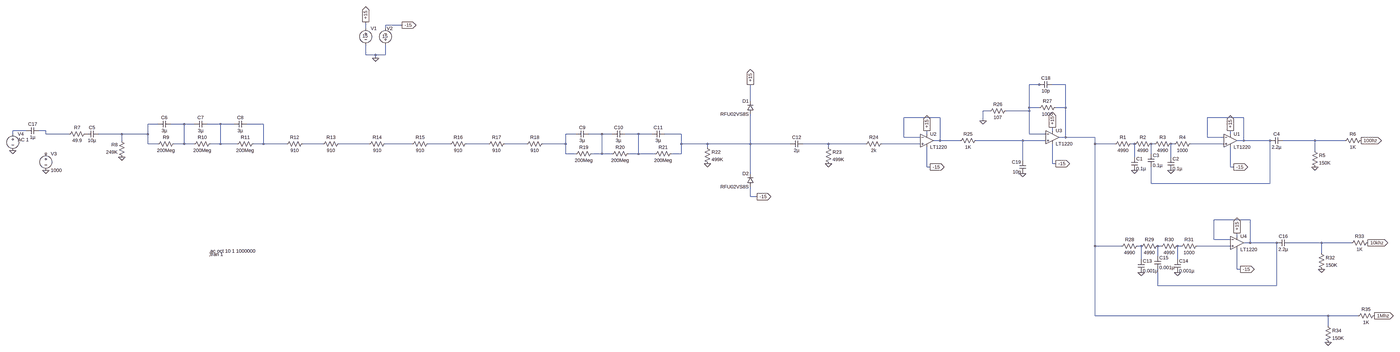
[diagram p0: schematic LPF for Noise Analysis.asc, whole sheet]
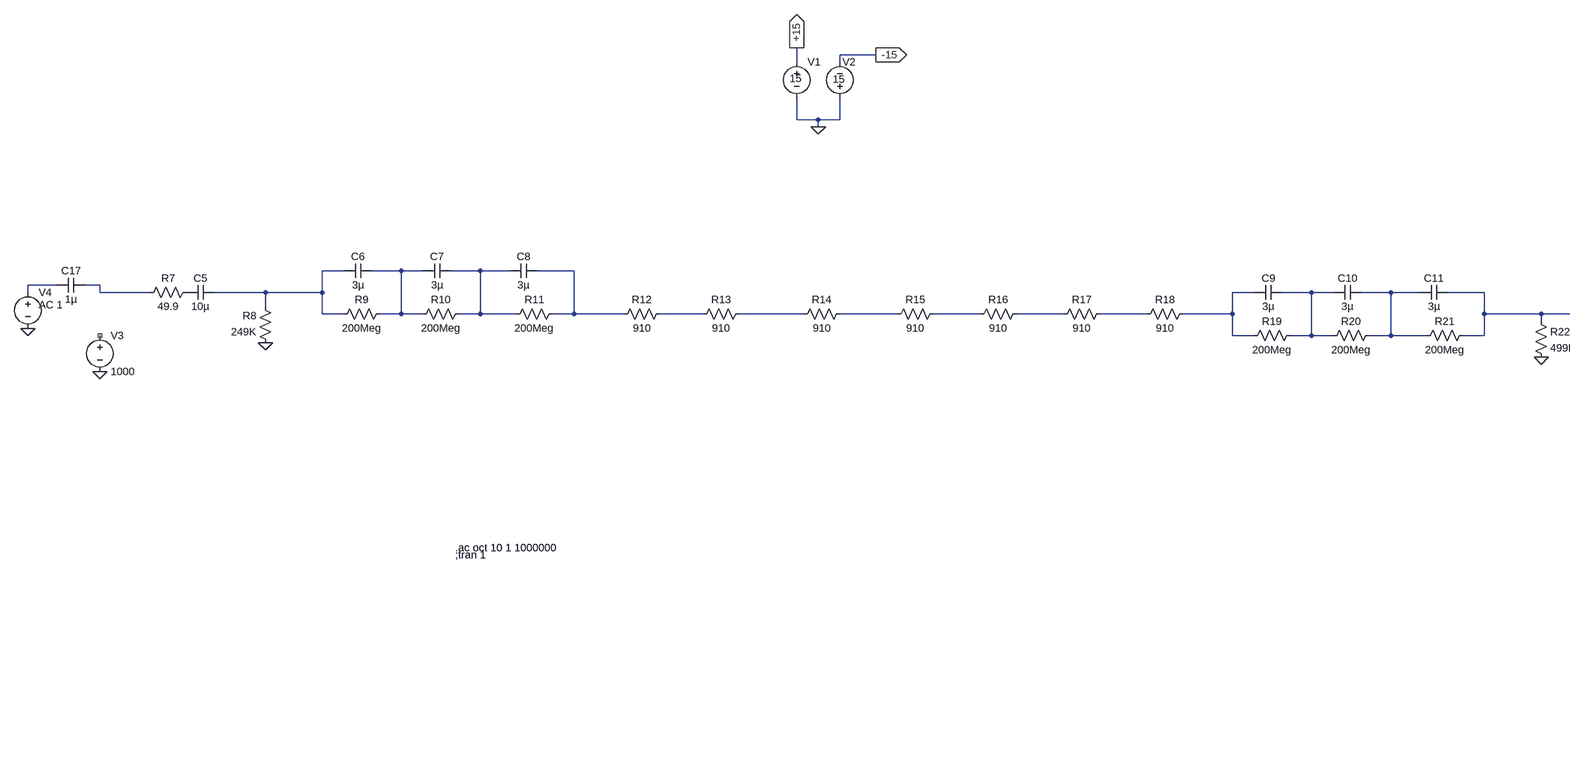
[diagram p1: schematic LPF for Noise Analysis.asc, part, row 1 of 1, column 1 of 2]
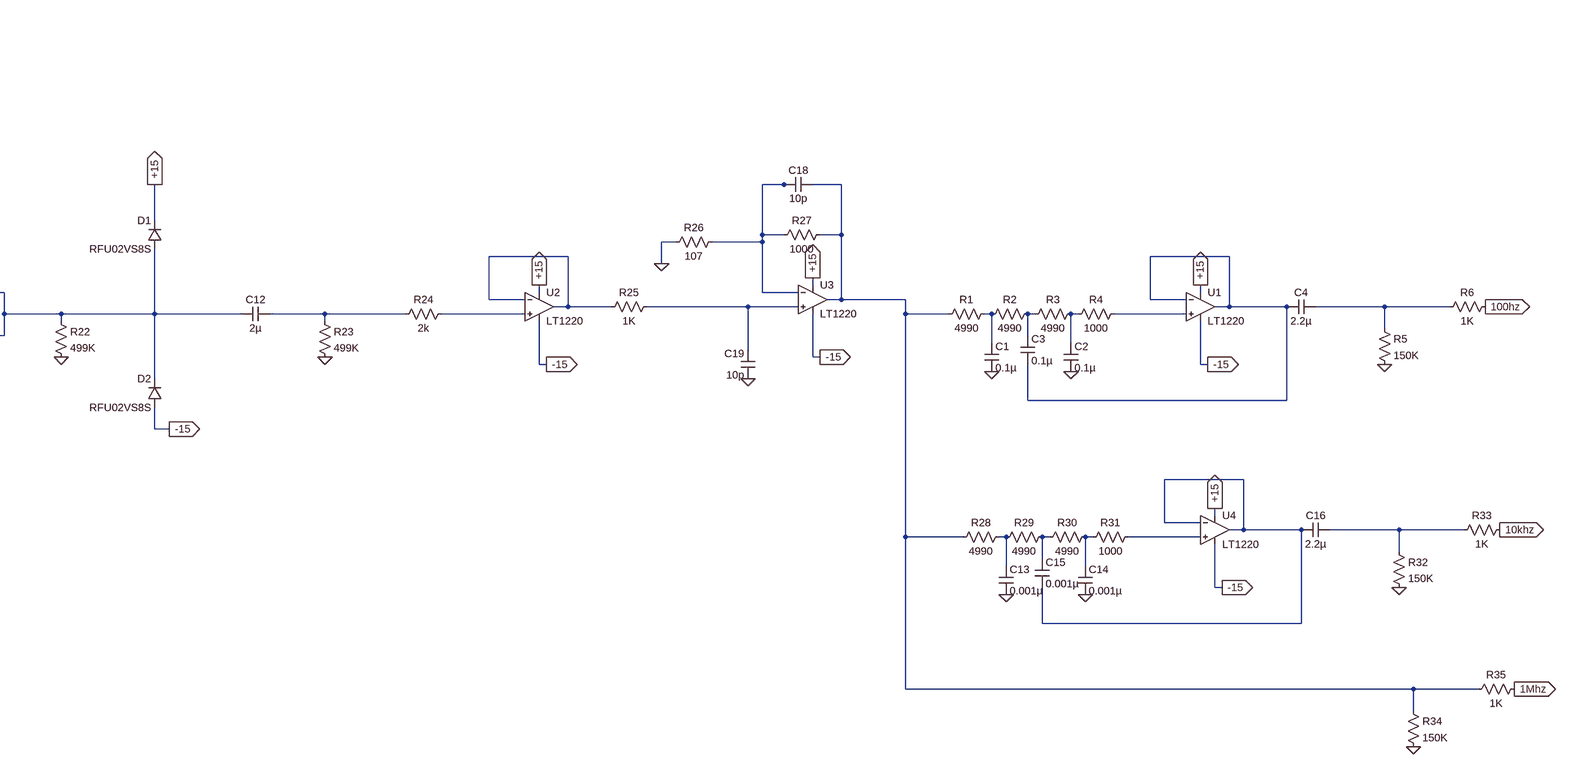
[diagram p2: schematic LPF for Noise Analysis.asc, part, row 1 of 1, column 2 of 2]
LPF for Noise Analysis.asc, the LTspice schematic file:
Version 4
SHEET 1 6236 1380
WIRE 688 -704 608 -704
WIRE 512 -688 512 -720
WIRE 608 -688 608 -704
WIRE 512 -560 512 -608
WIRE 560 -560 512 -560
WIRE 608 -560 608 -608
WIRE 608 -560 560 -560
WIRE 560 -544 560 -560
WIRE 4352 -416 4304 -416
WIRE 4368 -416 4352 -416
WIRE 4480 -416 4416 -416
WIRE 2800 -336 2800 -416
WIRE 4304 -304 4304 -416
WIRE 4352 -304 4304 -304
WIRE 4480 -304 4480 -416
WIRE 4480 -304 4432 -304
WIRE 4112 -288 4080 -288
WIRE 4304 -288 4304 -304
WIRE 4304 -288 4192 -288
WIRE 3872 -256 3696 -256
WIRE 5472 -256 5296 -256
WIRE 4080 -240 4080 -288
WIRE -560 -224 -608 -224
WIRE -432 -224 -496 -224
WIRE -384 -224 -432 -224
WIRE -256 -224 -320 -224
WIRE -192 -224 -256 -224
WIRE -48 -224 -128 -224
WIRE -1248 -192 -1312 -192
WIRE -1152 -192 -1184 -192
WIRE 4416 -192 4416 -208
WIRE -1312 -176 -1312 -192
WIRE -1152 -176 -1152 -192
WIRE -1040 -176 -1152 -176
WIRE -784 -176 -896 -176
WIRE -608 -176 -608 -224
WIRE -608 -176 -784 -176
WIRE 1952 -176 1904 -176
WIRE 2080 -176 2016 -176
WIRE 2128 -176 2080 -176
WIRE 2256 -176 2192 -176
WIRE 2320 -176 2256 -176
WIRE 2464 -176 2384 -176
WIRE 3808 -176 3808 -192
WIRE 4304 -176 4304 -288
WIRE 4384 -176 4304 -176
WIRE 5408 -176 5408 -192
WIRE 3696 -160 3696 -256
WIRE 3776 -160 3696 -160
WIRE 4480 -160 4480 -304
WIRE 4480 -160 4448 -160
WIRE 4752 -160 4480 -160
WIRE 5296 -160 5296 -256
WIRE 5376 -160 5296 -160
WIRE -784 -144 -784 -176
WIRE 3872 -144 3872 -256
WIRE 3872 -144 3840 -144
WIRE 3968 -144 3872 -144
WIRE 4272 -144 4048 -144
WIRE 4384 -144 4272 -144
WIRE 5472 -144 5472 -256
WIRE 5472 -144 5440 -144
WIRE 5600 -144 5472 -144
WIRE 5824 -144 5664 -144
WIRE 5968 -144 5824 -144
WIRE -608 -128 -608 -176
WIRE -560 -128 -608 -128
WIRE -432 -128 -432 -224
WIRE -432 -128 -480 -128
WIRE -384 -128 -432 -128
WIRE -256 -128 -256 -224
WIRE -256 -128 -304 -128
WIRE -176 -128 -256 -128
WIRE -48 -128 -48 -224
WIRE -48 -128 -96 -128
WIRE 128 -128 -48 -128
WIRE 304 -128 208 -128
WIRE 528 -128 384 -128
WIRE 736 -128 608 -128
WIRE 1152 -128 816 -128
WIRE 1376 -128 1232 -128
WIRE 1584 -128 1456 -128
WIRE 1904 -128 1904 -176
WIRE 1904 -128 1664 -128
WIRE 2464 -128 2464 -176
WIRE 2592 -128 2464 -128
WIRE 2800 -128 2800 -272
WIRE 2800 -128 2592 -128
WIRE 2992 -128 2800 -128
WIRE 3280 -128 3056 -128
WIRE 3504 -128 3280 -128
WIRE 3776 -128 3584 -128
WIRE 4752 -128 4752 -160
WIRE 4848 -128 4752 -128
WIRE 4944 -128 4928 -128
WIRE 5040 -128 5024 -128
WIRE 5136 -128 5120 -128
WIRE 5376 -128 5216 -128
WIRE 2592 -112 2592 -128
WIRE 3280 -112 3280 -128
WIRE 5824 -96 5824 -144
WIRE 1904 -80 1904 -128
WIRE 1952 -80 1904 -80
WIRE 2080 -80 2080 -176
WIRE 2080 -80 2032 -80
WIRE 2128 -80 2080 -80
WIRE 2256 -80 2256 -176
WIRE 2256 -80 2208 -80
WIRE 2336 -80 2256 -80
WIRE 2464 -80 2464 -128
WIRE 2464 -80 2416 -80
WIRE 5024 -80 5024 -128
WIRE 4944 -64 4944 -128
WIRE 5120 -64 5120 -128
WIRE 4272 -48 4272 -144
WIRE 4416 -32 4416 -128
WIRE 4432 -32 4416 -32
WIRE 3808 -16 3808 -112
WIRE 3824 -16 3808 -16
WIRE 5408 -16 5408 -112
WIRE 5424 -16 5408 -16
WIRE 2800 16 2800 -128
WIRE 5024 64 5024 -16
WIRE 5600 64 5600 -144
WIRE 5600 64 5024 64
WIRE 2800 128 2800 80
WIRE 2832 128 2800 128
WIRE 5504 240 5328 240
WIRE 5440 320 5440 304
WIRE 5328 336 5328 240
WIRE 5408 336 5328 336
WIRE 5504 352 5504 240
WIRE 5504 352 5472 352
WIRE 5632 352 5504 352
WIRE 5856 352 5696 352
WIRE 6000 352 5856 352
WIRE 4752 368 4752 -128
WIRE 4880 368 4752 368
WIRE 4976 368 4960 368
WIRE 5072 368 5056 368
WIRE 5168 368 5152 368
WIRE 5408 368 5248 368
WIRE 5856 400 5856 352
WIRE 5056 416 5056 368
WIRE 4976 432 4976 368
WIRE 5152 432 5152 368
WIRE 5440 480 5440 384
WIRE 5456 480 5440 480
WIRE 5056 560 5056 480
WIRE 5632 560 5632 352
WIRE 5632 560 5056 560
WIRE 4752 736 4752 368
WIRE 5888 736 4752 736
WIRE 6032 736 5888 736
WIRE 5888 784 5888 736
FLAG 560 -544 0
FLAG 688 -704 -15
IOPIN 688 -704 Out
FLAG 512 -720 +15
IOPIN 512 -720 Out
FLAG 5424 -16 -15
IOPIN 5424 -16 Out
FLAG 4944 0 0
FLAG 5120 0 0
FLAG 5408 -192 +15
IOPIN 5408 -192 Out
FLAG 6048 -144 100hz
IOPIN 6048 -144 Out
FLAG 5824 -16 0
FLAG -1152 0 0
FLAG -784 -64 0
FLAG 2592 -32 0
FLAG 2832 128 -15
IOPIN 2832 128 Out
FLAG 2800 -416 +15
IOPIN 2800 -416 Out
FLAG 3280 -32 0
FLAG 3824 -16 -15
IOPIN 3824 -16 Out
FLAG 3808 -192 +15
IOPIN 3808 -192 Out
FLAG 4432 -32 -15
IOPIN 4432 -32 Out
FLAG 4416 -208 +15
IOPIN 4416 -208 Out
FLAG 4080 -240 0
FLAG 5456 480 -15
IOPIN 5456 480 Out
FLAG 4976 496 0
FLAG 5152 496 0
FLAG 5440 304 +15
IOPIN 5440 304 Out
FLAG 6080 352 10khz
IOPIN 6080 352 Out
FLAG 5856 480 0
FLAG -1312 -96 0
FLAG 4272 16 0
FLAG 6112 736 1Mhz
IOPIN 6112 736 Out
FLAG 5888 864 0
SYMBOL Opamps\\LT1220 5408 -208 R0
SYMATTR InstName U1
SYMBOL voltage 512 -704 R0
WINDOW 3 -16 53 Left 2
WINDOW 123 0 0 Left 2
WINDOW 39 0 0 Left 2
SYMATTR Value 15
SYMATTR InstName V1
SYMBOL voltage 608 -592 R180
WINDOW 0 -35 96 Left 2
WINDOW 3 -11 58 Left 2
WINDOW 123 0 0 Left 2
WINDOW 39 0 0 Left 2
SYMATTR InstName V2
SYMATTR Value 15
SYMBOL res 4944 -144 R90
WINDOW 0 0 56 VBottom 2
WINDOW 3 32 56 VTop 2
SYMATTR InstName R1
SYMATTR Value 4990
SYMBOL res 5040 -144 R90
WINDOW 0 0 56 VBottom 2
WINDOW 3 32 56 VTop 2
SYMATTR InstName R2
SYMATTR Value 4990
SYMBOL res 5136 -144 R90
WINDOW 0 0 56 VBottom 2
WINDOW 3 32 56 VTop 2
SYMATTR InstName R3
SYMATTR Value 4990
SYMBOL res 5232 -144 R90
WINDOW 0 0 56 VBottom 2
WINDOW 3 32 56 VTop 2
SYMATTR InstName R4
SYMATTR Value 1000
SYMBOL cap 4928 -64 R0
SYMATTR InstName C1
SYMATTR Value 0.1µ
SYMATTR SpiceLine V=100 Irms=2.1 Rser=0.0606238 Lser=0 mfg="KEMET" pn="C1210C104K1RAC" type="X7R"
SYMBOL cap 5104 -64 R0
SYMATTR InstName C2
SYMATTR Value 0.1µ
SYMATTR SpiceLine V=100 Irms=950m Rser=0.0765605 Lser=0 mfg="KEMET" pn="C2225C104K1RAC" type="X7R"
SYMBOL cap 5008 -80 R0
SYMATTR InstName C3
SYMATTR Value 0.1µ
SYMATTR SpiceLine V=100 Irms=1.02 Rser=0.0850352 Lser=0 mfg="KEMET" pn="C1206F104K1RAC" type="X7R"
SYMBOL cap 5664 -160 R90
WINDOW 0 0 32 VBottom 2
WINDOW 3 32 32 VTop 2
SYMATTR InstName C4
SYMATTR Value 2.2µ
SYMATTR SpiceLine V=100 Irms=5.73 Rser=0.0196416 Lser=0 mfg="KEMET" pn="C1210C225K1RAC" type="X7R"
SYMBOL res 5808 -112 R0
SYMATTR InstName R5
SYMATTR Value 150K
SYMBOL res 6064 -160 R90
WINDOW 0 0 56 VBottom 2
WINDOW 3 32 56 VTop 2
SYMATTR InstName R6
SYMATTR Value 1K
SYMBOL voltage -1152 -96 R0
WINDOW 123 24 124 Left 2
WINDOW 39 0 0 Left 2
SYMATTR InstName V3
SYMATTR Value 1000
SYMBOL res -944 -192 R90
WINDOW 0 0 56 VBottom 2
WINDOW 3 32 56 VTop 2
SYMATTR InstName R7
SYMATTR Value 49.9
SYMBOL res -768 -48 R180
WINDOW 0 36 76 Left 2
WINDOW 3 36 40 Left 2
SYMATTR InstName R8
SYMATTR Value 249K
SYMBOL res -576 -112 R270
WINDOW 0 32 56 VTop 2
WINDOW 3 0 56 VBottom 2
SYMATTR InstName R9
SYMATTR Value 200Meg
SYMBOL res -400 -112 R270
WINDOW 0 32 56 VTop 2
WINDOW 3 0 56 VBottom 2
SYMATTR InstName R10
SYMATTR Value 200Meg
SYMBOL res -192 -112 R270
WINDOW 0 32 56 VTop 2
WINDOW 3 0 56 VBottom 2
SYMATTR InstName R11
SYMATTR Value 200Meg
SYMBOL res 112 -112 R270
WINDOW 0 32 56 VTop 2
WINDOW 3 0 56 VBottom 2
SYMATTR InstName R12
SYMATTR Value 910
SYMBOL res 288 -112 R270
WINDOW 0 32 56 VTop 2
WINDOW 3 0 56 VBottom 2
SYMATTR InstName R13
SYMATTR Value 910
SYMBOL res 512 -112 R270
WINDOW 0 32 56 VTop 2
WINDOW 3 0 56 VBottom 2
SYMATTR InstName R14
SYMATTR Value 910
SYMBOL res 720 -112 R270
WINDOW 0 32 56 VTop 2
WINDOW 3 0 56 VBottom 2
SYMATTR InstName R15
SYMATTR Value 910
SYMBOL cap -896 -192 R90
WINDOW 0 0 32 VBottom 2
WINDOW 3 32 32 VTop 2
SYMATTR InstName C5
SYMATTR Value 10µ
SYMBOL cap -496 -240 R90
WINDOW 0 0 32 VBottom 2
WINDOW 3 32 32 VTop 2
SYMATTR InstName C6
SYMATTR Value 3µ
SYMBOL cap -320 -240 R90
WINDOW 0 0 32 VBottom 2
WINDOW 3 32 32 VTop 2
SYMATTR InstName C7
SYMATTR Value 3µ
SYMBOL cap -128 -240 R90
WINDOW 0 0 32 VBottom 2
WINDOW 3 32 32 VTop 2
SYMATTR InstName C8
SYMATTR Value 3µ
SYMBOL res 1136 -112 R270
WINDOW 0 32 56 VTop 2
WINDOW 3 0 56 VBottom 2
SYMATTR InstName R16
SYMATTR Value 910
SYMBOL res 1360 -112 R270
WINDOW 0 32 56 VTop 2
WINDOW 3 0 56 VBottom 2
SYMATTR InstName R17
SYMATTR Value 910
SYMBOL res 1568 -112 R270
WINDOW 0 32 56 VTop 2
WINDOW 3 0 56 VBottom 2
SYMATTR InstName R18
SYMATTR Value 910
SYMBOL res 1936 -64 R270
WINDOW 0 32 56 VTop 2
WINDOW 3 0 56 VBottom 2
SYMATTR InstName R19
SYMATTR Value 200Meg
SYMBOL res 2112 -64 R270
WINDOW 0 32 56 VTop 2
WINDOW 3 0 56 VBottom 2
SYMATTR InstName R20
SYMATTR Value 200Meg
SYMBOL res 2320 -64 R270
WINDOW 0 32 56 VTop 2
WINDOW 3 0 56 VBottom 2
SYMATTR InstName R21
SYMATTR Value 200Meg
SYMBOL cap 2016 -192 R90
WINDOW 0 0 32 VBottom 2
WINDOW 3 32 32 VTop 2
SYMATTR InstName C9
SYMATTR Value 3µ
SYMBOL cap 2192 -192 R90
WINDOW 0 0 32 VBottom 2
WINDOW 3 32 32 VTop 2
SYMATTR InstName C10
SYMATTR Value 3µ
SYMBOL cap 2384 -192 R90
WINDOW 0 0 32 VBottom 2
WINDOW 3 32 32 VTop 2
SYMATTR InstName C11
SYMATTR Value 3µ
SYMBOL diode 2816 -272 R180
WINDOW 0 24 64 Left 2
WINDOW 3 24 0 Left 2
SYMATTR InstName D1
SYMATTR Value RFU02VS8S
SYMBOL diode 2816 80 R180
WINDOW 0 24 64 Left 2
WINDOW 3 24 0 Left 2
SYMATTR InstName D2
SYMATTR Value RFU02VS8S
SYMBOL res 2576 -128 R0
SYMATTR InstName R22
SYMATTR Value 499K
SYMBOL cap 3056 -144 R90
WINDOW 0 0 32 VBottom 2
WINDOW 3 32 32 VTop 2
SYMATTR InstName C12
SYMATTR Value 2µ
SYMBOL res 3264 -128 R0
SYMATTR InstName R23
SYMATTR Value 499K
SYMBOL res 3600 -144 R90
WINDOW 0 0 56 VBottom 2
WINDOW 3 32 56 VTop 2
SYMATTR InstName R24
SYMATTR Value 2k
SYMBOL Opamps\\LT1220 3808 -208 R0
SYMATTR InstName U2
SYMBOL Opamps\\LT1220 4416 -224 R0
SYMATTR InstName U3
SYMBOL res 4064 -160 R90
WINDOW 0 0 56 VBottom 2
WINDOW 3 32 56 VTop 2
SYMATTR InstName R25
SYMATTR Value 1K
SYMBOL res 4208 -304 R90
WINDOW 0 0 56 VBottom 2
WINDOW 3 32 56 VTop 2
SYMATTR InstName R26
SYMATTR Value 107
SYMBOL res 4448 -320 R90
WINDOW 0 0 56 VBottom 2
WINDOW 3 32 56 VTop 2
SYMATTR InstName R27
SYMATTR Value 1000
SYMBOL Opamps\\LT1220 5440 288 R0
SYMATTR InstName U4
SYMBOL res 4976 352 R90
WINDOW 0 0 56 VBottom 2
WINDOW 3 32 56 VTop 2
SYMATTR InstName R28
SYMATTR Value 4990
SYMBOL res 5072 352 R90
WINDOW 0 0 56 VBottom 2
WINDOW 3 32 56 VTop 2
SYMATTR InstName R29
SYMATTR Value 4990
SYMBOL res 5168 352 R90
WINDOW 0 0 56 VBottom 2
WINDOW 3 32 56 VTop 2
SYMATTR InstName R30
SYMATTR Value 4990
SYMBOL res 5264 352 R90
WINDOW 0 0 56 VBottom 2
WINDOW 3 32 56 VTop 2
SYMATTR InstName R31
SYMATTR Value 1000
SYMBOL cap 4960 432 R0
SYMATTR InstName C13
SYMATTR Value 0.001µ
SYMATTR SpiceLine V=100 Irms=83.8m Rser=2.70485 Lser=0 mfg="KEMET" pn="C0805C102K1RAC" type="X7R"
SYMBOL cap 5136 432 R0
SYMATTR InstName C14
SYMATTR Value 0.001µ
SYMATTR SpiceLine V=100 Irms=55.6m Rser=5.11126 Lser=0 mfg="KEMET" pn="C0603C102K1RAC" type="X7R"
SYMBOL cap 5040 416 R0
SYMATTR InstName C15
SYMATTR Value 0.001µ
SYMATTR SpiceLine V=100 Irms=83.8m Rser=2.70485 Lser=0 mfg="KEMET" pn="C0805C102K1RAC" type="X7R"
SYMBOL cap 5696 336 R90
WINDOW 0 0 32 VBottom 2
WINDOW 3 32 32 VTop 2
SYMATTR InstName C16
SYMATTR Value 2.2µ
SYMATTR SpiceLine V=100 Irms=5.73 Rser=0.0196416 Lser=0 mfg="KEMET" pn="C1210C225K1RAC" type="X7R"
SYMBOL res 5840 384 R0
SYMATTR InstName R32
SYMATTR Value 150K
SYMBOL res 6096 336 R90
WINDOW 0 0 56 VBottom 2
WINDOW 3 32 56 VTop 2
SYMATTR InstName R33
SYMATTR Value 1K
SYMBOL voltage -1312 -192 R0
WINDOW 123 24 44 Left 2
WINDOW 39 0 0 Left 2
SYMATTR Value2 AC 1
SYMATTR InstName V4
SYMATTR Value ""
SYMBOL cap -1184 -208 R90
WINDOW 0 0 32 VBottom 2
WINDOW 3 32 32 VTop 2
SYMATTR InstName C17
SYMATTR Value 1µ
SYMBOL cap 4416 -432 R90
WINDOW 0 0 32 VBottom 2
WINDOW 3 32 32 VTop 2
SYMATTR InstName C18
SYMATTR Value 10p
SYMBOL cap 4288 16 R180
WINDOW 0 24 56 Left 2
WINDOW 3 24 8 Left 2
SYMATTR InstName C19
SYMATTR Value 10p
SYMBOL res 5872 768 R0
SYMATTR InstName R34
SYMATTR Value 150K
SYMBOL res 6128 720 R90
WINDOW 0 0 56 VBottom 2
WINDOW 3 32 56 VTop 2
SYMATTR InstName R35
SYMATTR Value 1K
TEXT -312 392 Left 2 !.ac oct 10 1 1000000
TEXT -312 408 Left 2 !;tran 1

The netlist it stands for:
* LPF for Noise Analysis.asc
XU1 N028 N004 +15 -15 N004 LT1220  ; pins In+ In- V+ V- OUT
V1 +15 0 15
V2 0 -15 15
R1 N025 N002 4990
R2 N026 N025 4990
R3 N027 N026 4990
R4 N028 N027 1000
C1 N025 0 0.1µ V=100 Irms=2.1 Rser=0.0606238 Lser=0 mfg="KEMET" pn="C1210C104K1RAC" type="X7R"
C2 N027 0 0.1µ V=100 Irms=950m Rser=0.0765605 Lser=0 mfg="KEMET" pn="C2225C104K1RAC" type="X7R"
C3 N026 N004 0.1µ V=100 Irms=1.02 Rser=0.0850352 Lser=0 mfg="KEMET" pn="C1206F104K1RAC" type="X7R"
C4 N016 N004 2.2µ V=100 Irms=5.73 Rser=0.0196416 Lser=0 mfg="KEMET" pn="C1210C225K1RAC" type="X7R"
R5 N016 0 150K
R6 100hz N016 1K
V3 NC_01 0 1000
R7 P001 N010 49.9
R8 0 N005 249K
R9 N005 N006 200Meg
R10 N006 N007 200Meg
R11 N007 N008 200Meg
R12 N008 N017 910
R13 N017 N018 910
R14 N018 N019 910
R15 N019 N020 910
C5 N005 P001 10µ
C6 N006 N005 3µ
C7 N007 N006 3µ
C8 N008 N007 3µ
R16 N020 N021 910
R17 N021 N022 910
R18 N022 N011 910
R19 N011 N012 200Meg
R20 N012 N013 200Meg
R21 N013 N014 200Meg
C9 N012 N011 3µ
C10 N013 N012 3µ
C11 N014 N013 3µ
D1 N014 +15 RFU02VS8S
D2 -15 N014 RFU02VS8S
R22 N014 0 499K
C12 N023 N014 2µ
R23 N023 0 499K
R24 N024 N023 2k
XU2 N024 N003 +15 -15 N003 LT1220  ; pins In+ In- V+ V- OUT
XU3 N015 N001 +15 -15 N002 LT1220  ; pins In+ In- V+ V- OUT
R25 N015 N003 1K
R26 N001 0 107
R27 N002 N001 1000
XU4 N034 N029 +15 -15 N029 LT1220  ; pins In+ In- V+ V- OUT
R28 N031 N002 4990
R29 N032 N031 4990
R30 N033 N032 4990
R31 N034 N033 1000
C13 N031 0 0.001µ V=100 Irms=83.8m Rser=2.70485 Lser=0 mfg="KEMET" pn="C0805C102K1RAC" type="X7R"
C14 N033 0 0.001µ V=100 Irms=55.6m Rser=5.11126 Lser=0 mfg="KEMET" pn="C0603C102K1RAC" type="X7R"
C15 N032 N029 0.001µ V=100 Irms=83.8m Rser=2.70485 Lser=0 mfg="KEMET" pn="C0805C102K1RAC" type="X7R"
C16 N030 N029 2.2µ V=100 Irms=5.73 Rser=0.0196416 Lser=0 mfg="KEMET" pn="C1210C225K1RAC" type="X7R"
R32 N030 0 150K
R33 10khz N030 1K
V4 N009 0 AC 1
C17 N010 N009 1µ
C18 N002 N001 10p
C19 0 N015 10p
R34 N002 0 150K
R35 1Mhz N002 1K
.model D D
.lib standard.dio
.ac oct 10 1 1000000
;tran 1
.backanno
.end